# EAGLE design 6-pin-breakout (EAGLE 7.7.0)
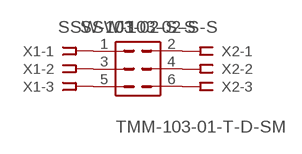
[diagram p0: schematic, sheet 1]

## Parts
J1  TMM-103-01-T-D-SM  [2MM-SMD-HEADER-2X3]
X1  SSW-103-02-S-S  [SSW-103-02-S-S]
X2  SSW-103-02-S-S  [SSW-103-02-S-S]

## Nets
N$1: J1.1 X1.1
N$2: J1.3 X1.2
N$3: J1.5 X1.3
N$4: J1.2 X2.1
N$5: J1.4 X2.2
N$6: J1.6 X2.3

## Library data of the parts
J1 = GlenPartsLibrary:TMM-103-01-T-D-SM
X1 X2 = con-samtec:SSW-103-02-S-S: THROUGH-HOLE .025" SQ POST SOCKET Source: Samtec SSW.pdf; MPN: SSW-103-02-S-S; OC_FARNELL: unknown; OC_NEWARK: 11P9367

## Board
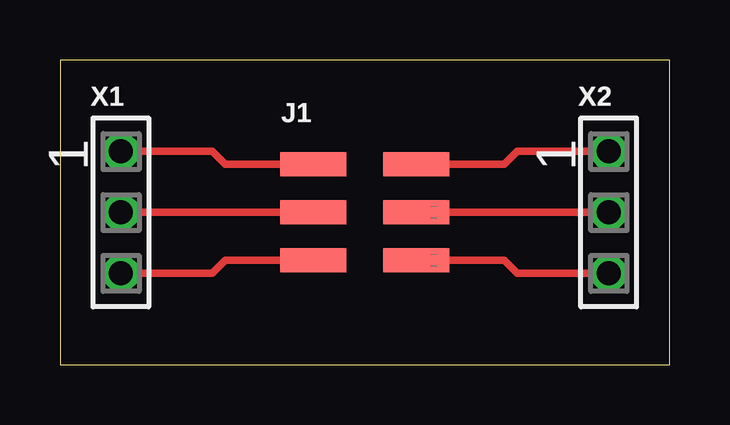
[diagram p1: board, top side]

Size 25.4 x 12.7 mm. Coordinates in mm from the lower left corner, seen from the top.
Outline: 0,0 25.4,0 25.4,12.7 0,12.7 0,0
Copper layers (1*16): Top 0.035mm / dielectric 1.5mm / Bottom 0.035mm
Design rules "default": minimum track width 10mil, minimum drill 24mil, track to track 8mil, track to pad 8mil, pad to pad 8mil, via to via 8mil, smd to smd 8mil, copper to edge 40mil, drill to drill 8mil, minimum pad ring 10mil, minimum via ring 8mil, stop-mask expansion 4mil, vias tented up to drill 0mil, thermal gap 10mil

### Footprints (pad centres in the part's own frame; a part is rotated, then mirrored left to right if it is on the bottom)
2MM-SMD-HEADER-2X3 = smd 1 x 2.75: 1 -2,-2.15; 2 -2,2.15; 3 0,-2.15; 4 0,2.15; 5 2,-2.15; 6 2,2.15
SSW-103-02-S-S = drill 1 pad 1.5 octagon: 1 -2.54,0; 2 0,0; 3 2.54,0

### Placement (x,y rotation side)
J1  12.7,6.35 270 top
X1  2.54,6.35 270 top
X2  22.86,6.35 270 top

### Tracks (layer width: path | path; a pad name or v marks a point on that pad's centre or on a via)
N$1
  Top 0.305: J1.1 6.89,8.35 6.35,8.89 X1.1
N$2
  Top 0.305: J1.3 X1.2
N$3
  Top 0.305: J1.5 6.89,4.35 6.35,3.81 X1.3
N$4
  Top 0.305: J1.2 18.51,8.35 19.05,8.89 X2.1
N$5
  Top 0.305: J1.4 X2.2
N$6
  Top 0.305: J1.6 18.51,4.35 19.05,3.81 X2.3

### Text on the board
_tsilk: X1 | X2 | J1